# Altium schematic sheet GEN2.SchDoc
size A; SheetNumber: 1; SheetTotal: 1
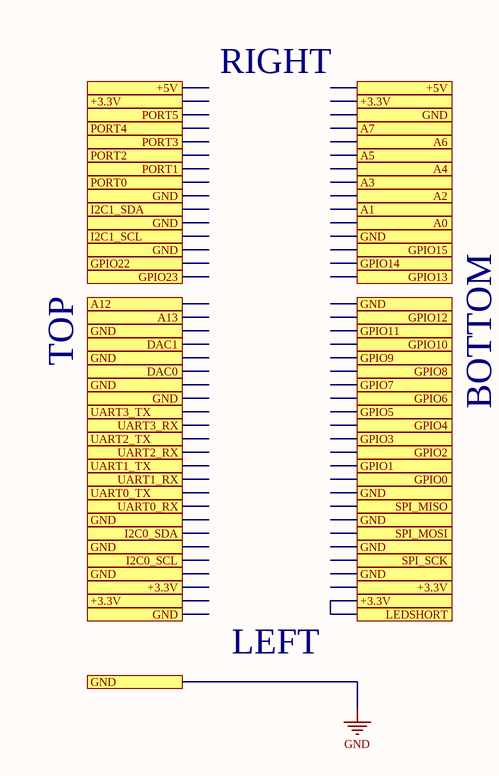
[diagram p0: GEN2.SchDoc]

## Ports
+3.3V (see GEN2[1A], GEN2[1C], GEN2[2A], GEN2[2C]), +3.3V (see GEN2[1A], GEN2[1C], GEN2[2C]), +3.3V (see GEN2[1C], GEN2[2A], GEN2[2C]), +5V (see GEN2[1A]), +5V (see GEN2[2A]), A0, A1, A2, A3, A4, A5, A6, A7, A12, A13, DAC0, DAC1, GND (see GEN2[1A], GEN2[1B], GEN2[1C], GEN2[2A], GEN2[2B], GEN2[2C]), GPIO0, GPIO1, GPIO2, GPIO3, GPIO4, GPIO5, GPIO6, GPIO7, GPIO8, GPIO9, GPIO10, GPIO11, GPIO12, GPIO13, GPIO14, GPIO15, GPIO22, GPIO23, I2C0_SCL, I2C0_SDA, I2C1_SCL, I2C1_SDA, LEDSHORT, PORT0, PORT1, PORT2, PORT3, PORT4, PORT5, SPI_MISO, SPI_MOSI, SPI_SCK, UART0_RX, UART0_TX, UART1_RX, UART1_TX, UART2_RX, UART2_TX, UART3_RX, UART3_TX

## Nets
GND: port GND
+3.3V: port +3.3V, port LEDSHORT

## Notes on the sheet
- RIGHT
- TOP
- BOTTOM
- LEFT